# Altium schematic sheet Voltage_Regulator and Level Shifters.SchDoc
size A; SheetNumber: 4; SheetTotal: 6
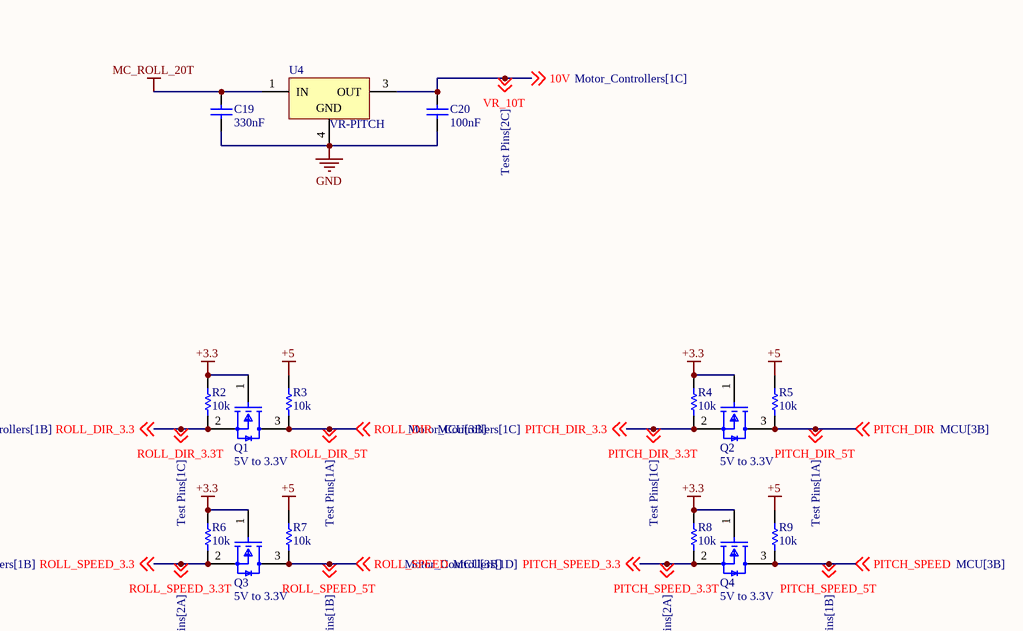
[diagram p0: Voltage_Regulator and Level Shifters.SchDoc]

## Parts
C19  330nF  [0805]
C20  100nF  [0805]
Q1  5V to 3.3V  [FP-318-08-IPC_B]
Q2  5V to 3.3V  [FP-318-08-IPC_B]
Q3  5V to 3.3V  [FP-318-08-IPC_B]
Q4  5V to 3.3V  [FP-318-08-IPC_B]
R2  10k  [0805]
R3  10k  [0805]
R4  10k  [0805]
R5  10k  [0805]
R6  10k  [0805]
R7  10k  [0805]
R8  10k  [0805]
R9  10k  [0805]
U4  VR-PITCH  [TO-263_N]

## Nets
+3.3: Q1.1(G) Q2.1(G) Q3.1(G) Q4.1(G) R2.2 R4.2 R6.2 R8.2
+5: R3.2 R5.2 R7.2 R9.2
GND: C19.1 C20.2 U4.4(GND)
MC_ROLL_20T: C19.2 U4.1(IN)
10V: C20.1 U4.3(OUT) ; off-sheet 10V, off-sheet VR_10T  [also labelled VR_10T]
PITCH_DIR: Q2.3(D) R5.1 ; off-sheet PITCH_DIR, off-sheet PITCH_DIR_5T  [also labelled PITCH_DIR_5T]
PITCH_DIR_3.3: Q2.2(S) R4.1 ; off-sheet PITCH_DIR_3.3, off-sheet PITCH_DIR_3.3T  [also labelled PITCH_DIR_3.3T]
PITCH_SPEED: Q4.3(D) R9.1 ; off-sheet PITCH_SPEED, off-sheet PITCH_SPEED_5T  [also labelled PITCH_SPEED_5T]
PITCH_SPEED_3.3: Q4.2(S) R8.1 ; off-sheet PITCH_SPEED_3.3, off-sheet PITCH_SPEED_3.3T  [also labelled PITCH_SPEED_3.3T]
ROLL_DIR: Q1.3(D) R3.1 ; off-sheet ROLL_DIR, off-sheet ROLL_DIR_5T  [also labelled ROLL_DIR_5T]
ROLL_DIR_3.3: Q1.2(S) R2.1 ; off-sheet ROLL_DIR_3.3, off-sheet ROLL_DIR_3.3T  [also labelled ROLL_DIR_3.3T]
ROLL_SPEED: Q3.3(D) R7.1 ; off-sheet ROLL_SPEED, off-sheet ROLL_SPEED_5T  [also labelled ROLL_SPEED_5T]
ROLL_SPEED_3.3: Q3.2(S) R6.1 ; off-sheet ROLL_SPEED_3.3, off-sheet ROLL_SPEED_3.3T  [also labelled ROLL_SPEED_3.3T]

## Library data of the parts
C19 = nF - 330nF (0.33uF): CAP Ceramic, 330nF, 50V, 0805; MPN: 0805B334K500NT; Manufacturer: FH (Guangdong Fenghua Advanced Tech); Capacitance: 330nF; JLCPCB Part #: C1740; Voltage Rating: 50V; JLCPCB Basic Part: TRUE
C20 = nF - 100nF (0.1uF): CAP Ceramic, 100nF, 50V, 0805; MPN: CC0805KRX7R9BB104; Manufacturer: YAGEO; Capacitance: 100nF; JLCPCB Part #: C49678; Voltage Rating: 50V; JLCPCB Basic Part: TRUE
Q1-Q4 = CMP-07173-000101-1: MOSFET N-CH 50V 220MA SOT-23; MPN: BSS138; Turn-Off Delay Time: 20ns; Element Configuration: Single; Rds On Max: 3.5R; Gate to Source Voltage (Vgs): 20V; Threshold Voltage: 1.3V; Number of Elements: 1; Power Dissipation: 360mW; Rise Time: 9ns; Turn-On Delay Time: 2.5ns; Input Capacitance: 27pF; On-State Resistance: 6R; Lead Free: Lead Free; Length: 2.92mm; Width: 1.3mm; Drain to Source Breakdown Voltage: 50V; Min Operating Temperature: -55°C; REACH SVHC: No SVHC; Packaging: Tape and Reel; Radiation Hardening: No; Height: 0.93mm; Drain to Source Voltage (Vdss): 50V; Current Rating: 220mA; Voltage Rating (DC): 50V; Weight: 0.03g; Continuous Drain Current (ID): 220mA; Number of Pins: 3; Nominal Vgs: 1.3V; Max Power Dissipation: 360mW; Fall Time: 9ns; Drain to Source Resistance: 3.5R; Contact Plating: Tin; Case/Package: SOT-23; Package Quantity: 1; Dual Supply Voltage: 50V; Mount: Surface Mount; Termination: SMD/SMT; Max Operating Temperature: 150°C
R2-R9 = 10000 (10k): RES Thick Film, 10kΩ, 0.125W, 150V, 0805; MPN: 0805W8F1002T5E; Manufacturer: UNI-ROYAL; Power Rating: 125mW; JLCPCB Part #: C17414; Voltage Rating: 150V; ComponentLink1Description: Source; ComponentLink1URL: https://jlcpcb.com/partdetail/18102-0805W8F1002T5E/C17414; Value: 10k; JLCPCB Basic Part: TRUE
U4 = CMP-0244-00182-1: Positive Voltage Regulator, 3-Pin D2PAK, Tape and Reel; PackageDescription: 3-Pin Transistor Outline Package 2.54 mm Pitch, 15.4 mm Lead Span (D2PAK); ComponentLink1Description: Manufacturer URL; PackageReference: TO-263; DatasheetVersion: 16/11/2011; ComponentLink2URL: http://www.st.com/internet/com/TECHNICAL_RESOURCES/TECHNICAL_LITERATURE/DATASHEET/CD00000444.pdf; ComponentLink1URL: http://www.st.com; PackageVersion: 2011; ComponentLink2Description: Datasheet